# Altium schematic sheet B34.SchDoc: ZoM Mod A - FPGA Bank 34
size A4; Organization: Trenz Electronic GmbH / TT; DocumentNumber: 7; Revision: 01; SheetNumber: 7; SheetTotal: 13; Date: 12/16/2014
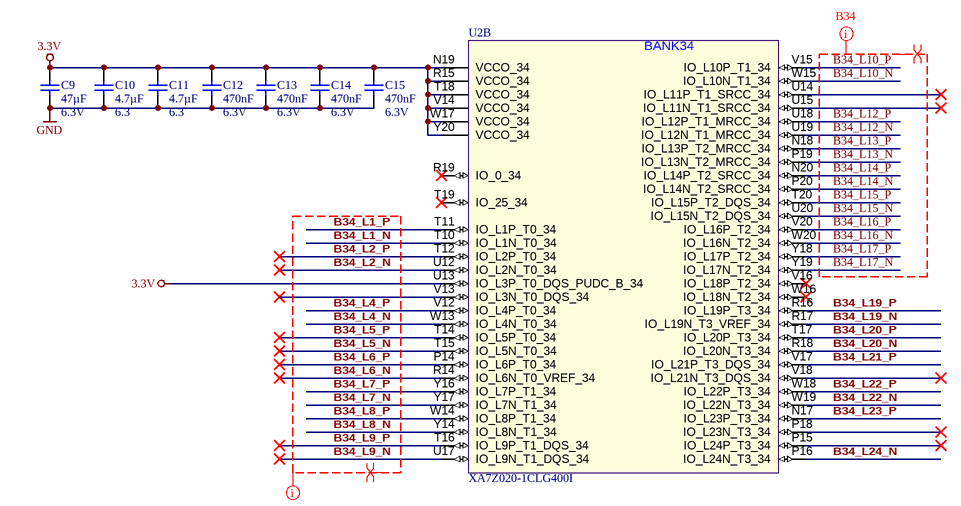
[diagram p0: B34.SchDoc]

## Parts
C9  47µF  Voltage: 6.3V  [CAPC3216X180N]
C10  4.7µF  Voltage: 6.3  [CAPC1005X60N]
C11  4.7µF  Voltage: 6.3  [CAPC1005X60N]
C12  470nF  Voltage: 6.3V  [CAPC0603X33N]
C13  470nF  Voltage: 6.3V  [CAPC0603X33N]
C14  470nF  Voltage: 6.3V  [CAPC0603X33N]
C15  470nF  Voltage: 6.3V  [CAPC0603X33N]
U2  XA7Z020-1CLG400I  [BGA400C80P20X20_1700X1700X160N]  (part B of 8)

## Nets
3.3V: C9.1 C10.1 C11.1 C12.1 C13.1 C14.1 C15.1 U2.N19(VCCO_34) U2.R15(VCCO_34) U2.T18(VCCO_34) U2.U13(IO_L3P_T0_DQS_PUDC_B_34) U2.V14(VCCO_34) U2.W17(VCCO_34) U2.Y20(VCCO_34)
GND: C9.2 C10.2 C11.2 C12.2 C13.2 C14.2 C15.2
B34_L1_N: U2.T10(IO_L1N_T0_34)
B34_L1_P: U2.T11(IO_L1P_T0_34)
B34_L2_N: U2.U12(IO_L2N_T0_34)
B34_L2_P: U2.T12(IO_L2P_T0_34)
B34_L4_N: U2.W13(IO_L4N_T0_34)
B34_L4_P: U2.V12(IO_L4P_T0_34)
B34_L5_N: U2.T15(IO_L5N_T0_34)
B34_L5_P: U2.T14(IO_L5P_T0_34)
B34_L6_N: U2.R14(IO_L6N_T0_VREF_34)
B34_L6_P: U2.P14(IO_L6P_T0_34)
B34_L7_N: U2.Y17(IO_L7N_T1_34)
B34_L7_P: U2.Y16(IO_L7P_T1_34)
B34_L8_N: U2.Y14(IO_L8N_T1_34)
B34_L8_P: U2.W14(IO_L8P_T1_34)
B34_L9_N: U2.U17(IO_L9N_T1_DQS_34)
B34_L9_P: U2.T16(IO_L9P_T1_DQS_34)
B34_L10_N: U2.W15(IO_L10N_T1_34)
B34_L10_P: U2.V15(IO_L10P_T1_34)
B34_L12_N: U2.U19(IO_L12N_T1_MRCC_34)
B34_L12_P: U2.U18(IO_L12P_T1_MRCC_34)
B34_L13_N: U2.P19(IO_L13N_T2_MRCC_34)
B34_L13_P: U2.N18(IO_L13P_T2_MRCC_34)
B34_L14_N: U2.P20(IO_L14N_T2_SRCC_34)
B34_L14_P: U2.N20(IO_L14P_T2_SRCC_34)
B34_L15_N: U2.U20(IO_L15N_T2_DQS_34)
B34_L15_P: U2.T20(IO_L15P_T2_DQS_34)
B34_L16_N: U2.W20(IO_L16N_T2_34)
B34_L16_P: U2.V20(IO_L16P_T2_34)
B34_L17_N: U2.Y19(IO_L17N_T2_34)
B34_L17_P: U2.Y18(IO_L17P_T2_34)
B34_L19_N: U2.R17(IO_L19N_T3_VREF_34)
B34_L19_P: U2.R16(IO_L19P_T3_34)
B34_L20_N: U2.R18(IO_L20N_T3_34)
B34_L20_P: U2.T17(IO_L20P_T3_34)
B34_L21_P: U2.V17(IO_L21P_T3_DQS_34)
B34_L22_N: U2.W19(IO_L22N_T3_34)
B34_L22_P: U2.W18(IO_L22P_T3_34)
B34_L23_P: U2.N17(IO_L23P_T3_34)
B34_L24_N: U2.P16(IO_L24N_T3_34)

Not connected (* = marked no-connect by the designer): U2 P15(IO_L24P_T3_34)* P18(IO_L23N_T3_34)* R19(IO_0_34)* T19(IO_25_34)* U14(IO_L11P_T1_SRCC_34)* U15(IO_L11N_T1_SRCC_34)* V13(IO_L3N_T0_DQS_34)* V16(IO_L18P_T2_34)* V18(IO_L21N_T3_DQS_34)* W16(IO_L18N_T2_34)*

## Layout directives
differential pair: B34_L1_N, B34_L1_P, B34_L2_N, B34_L2_P, B34_L4_N, B34_L4_P, B34_L5_N, B34_L5_P, B34_L6_N, B34_L6_P, B34_L7_N, B34_L7_P, B34_L8_N, B34_L8_P, B34_L9_N, B34_L9_P, B34_L10_N, B34_L10_P, B34_L12_N, B34_L12_P, B34_L13_N, B34_L13_P, B34_L14_N, B34_L14_P, B34_L15_N, B34_L15_P, B34_L16_N, B34_L16_P, B34_L17_N, B34_L17_P
net class B34: B34_L1_N, B34_L1_P, B34_L2_N, B34_L2_P, B34_L4_N, B34_L4_P, B34_L5_N, B34_L5_P, B34_L6_N, B34_L6_P, B34_L7_N, B34_L7_P, B34_L8_N, B34_L8_P, B34_L9_N, B34_L9_P, B34_L10_N, B34_L10_P, B34_L12_N, B34_L12_P, B34_L13_N, B34_L13_P, B34_L14_N, B34_L14_P, B34_L15_N, B34_L15_P, B34_L16_N, B34_L16_P, B34_L17_N, B34_L17_P

## Notes on the sheet
- Title:
- Nummer:
- Rev.
- Datum:
- A4
- Zeichner:
- Blatt
- von
- Filename:
- (in symbol 25981, part B) BANK34

## Library data of the parts
C9 = 24557: KON 47µF 6.3V  X5R SMD 20%; AN: 24557; Mixed: SMT; Value: 47u; Preferred: Yes; Technology: X5R; Case: 3216 (1206); Tolerance: 20%
C10 C11 = 24719: KON 4.7µF 6.3V X5R SMD; AN: 24719; Value: 4.7u; Mixed: SMT; Preferred: Yes; Case: 1005 (0402); Technology: X5R
C12-C15 = 24921: KON 470nF X5R 6.3V SMD; AN: 24921; Value: 470n; Tolerance: 20%; Mixed: SMT; Preferred: Yes; Case: 0603 (0201); Technology: X5R
U2 = 25981: AN: 25981; Mixed: SMT; Trenz-Stock: Yes; Case: CLG400; HelpURL: B:\AD\adlib\datasheet\XC7